# Altium project HalfBridgeDriverModule.PrjPcb
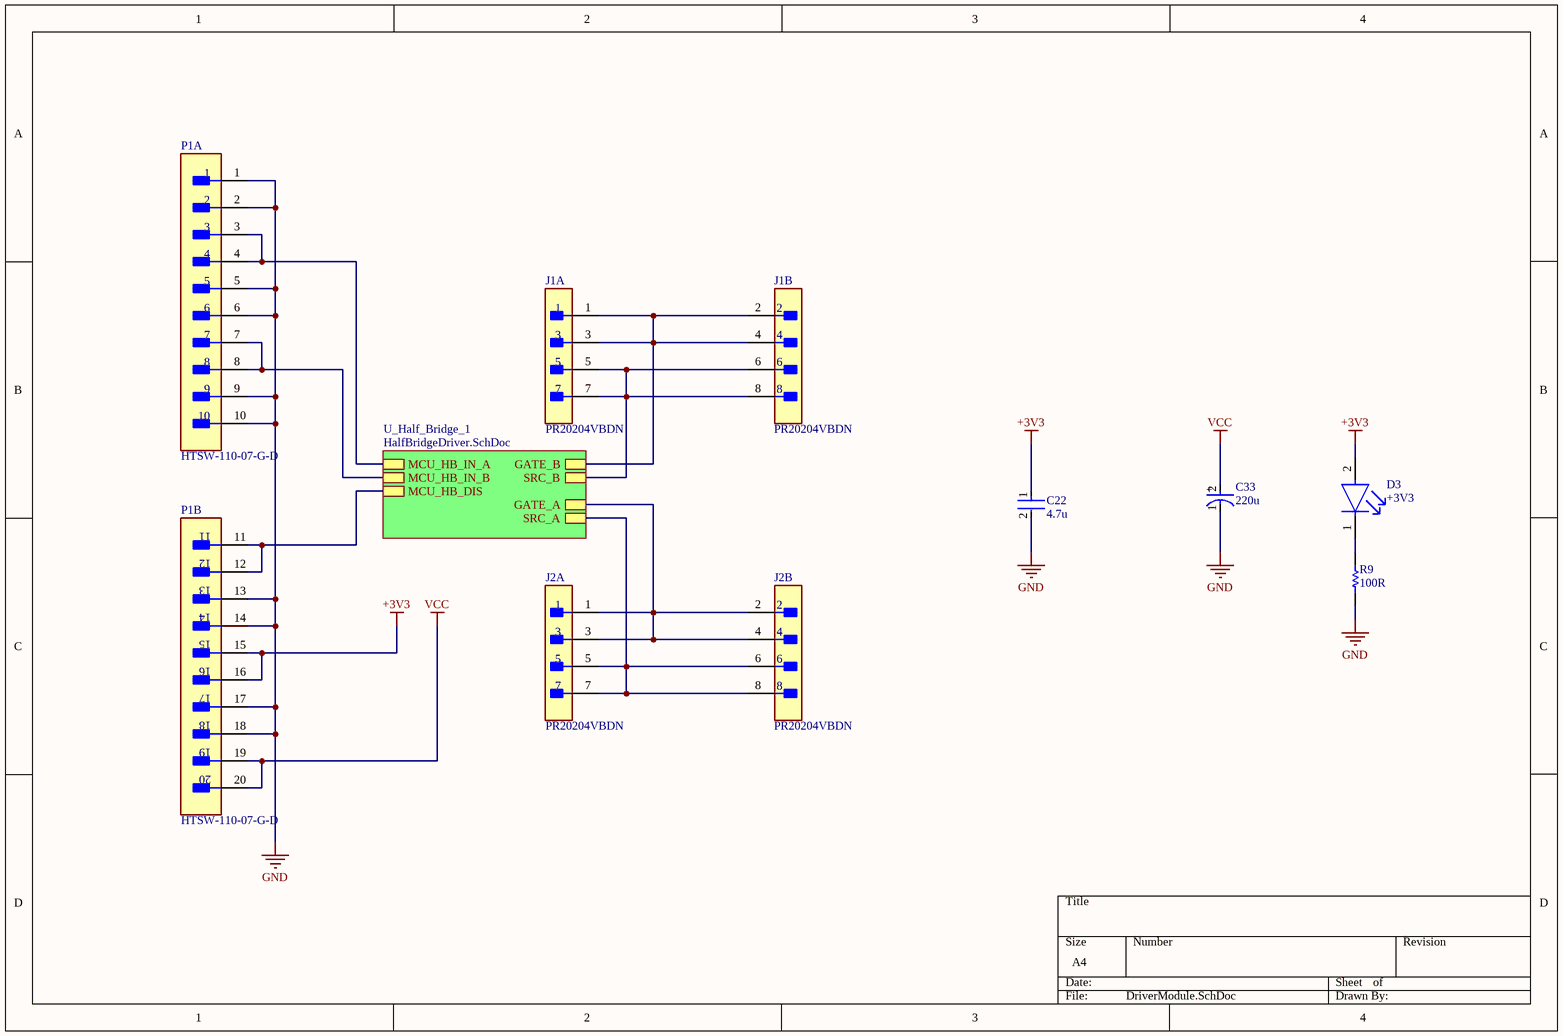
[diagram p0: DriverModule.SchDoc]
2 sheets, 37 parts. Net scope: hierarchical (ports join the sheet entries above them; power ports are global).
Board file: HalfBridgeDriverBoard.PcbDoc
Sheets:
  DriverModule.SchDoc
    U_Half_Bridge_1 = HalfBridgeDriver.SchDoc

## Sheet DriverModule.SchDoc
size A4; SheetNumber: 1; SheetTotal: 2

### Parts
C22  4.7u  [FP-GRM31C-0_2-e0_3_0_8-IPC_C]
C33  220u  [FP-RAD-TH-D_5_0_5-L_7_1-F-MFG]
D3  +3V3  [FP-LTST-C171KGKT-MFG]
J1  PR20204VBDN  [FP-PR20204VBDN-MFG]  (parts A,B of 2)
J2  PR20204VBDN  [FP-PR20204VBDN-MFG]  (parts A,B of 2)
P1  HTSW-110-07-G-D  [FP-HTSW-110-07-G-D-MFG]  (parts A,B of 2)
R9  100R  [RESC2013X60X35ML10T20]

### Sub-sheets
U_Half_Bridge_1 = HalfBridgeDriver.SchDoc: GATE_B, SRC_B, GATE_A, SRC_A, MCU_HB_IN_B, MCU_HB_IN_A, MCU_HB_DIS

### Nets
+3V3: C22.1 D3.2(A) P1.15 P1.16
GND: C22.2 C33.1(C) P1.1 P1.2 P1.5 P1.6 P1.9 P1.10 P1.13 P1.14 P1.17 P1.18 R9.1
VCC: C33.2(A) P1.19 P1.20
NetC12_2: J2.5 J2.6 J2.7 J2.8 ; sheet U_Half_Bridge_1/SRC_A
NetC18_2: J1.5 J1.6 J1.7 J1.8 ; sheet U_Half_Bridge_1/SRC_B
NetD1_1: J2.1 J2.2 J2.3 J2.4 ; sheet U_Half_Bridge_1/GATE_A
NetD2_1: J1.1 J1.2 J1.3 J1.4 ; sheet U_Half_Bridge_1/GATE_B
NetD3_1: D3.1(C) R9.2
NetP1_3: P1.3 P1.4 ; sheet U_Half_Bridge_1/MCU_HB_IN_A
NetP1_7: P1.7 P1.8 ; sheet U_Half_Bridge_1/MCU_HB_IN_B
NetP1_11: P1.11 P1.12 ; sheet U_Half_Bridge_1/MCU_HB_DIS

### Notes on the sheet
- (in symbol CMP-05427-001207-1) +

### Library data of the parts
C22 = CMP-06035-057352-1: Chip Multilayer Ceramic Capacitors for General Purpose, 1206, 4.7uF, X7R, 15%, 20%, 50V; Height: 1.6mm; Capacitance: 4.7uF; Radiation Hardening: No; Min Operating Temperature: -55°C; Tolerance: 20%; Packaging: Tape and Reel; Case Code (Imperial): 1206; Mount: Surface Mount; Termination: SMD/SMT; Case/Package: 1206; Depth: 1.6mm; Width: 0.063inch; Max Operating Temperature: 125°C; Thickness: 0.071inch; Voltage Rating (DC): 50V; Package Quantity: 2000; Voltage Rating: 50V; Lead Free: Lead Free; Length: 3.2mm; Case Code (Metric): 3216; Dielectric: X7R
C33 = CMP-05427-001207-1: Aluminum Electrolytic Capacitors (Radial Lead Type) 22uF ±20% 25V; Ripple Current: 55mA; Life (Hours): 1000Hour; Length: 7mm; Series: KA; RoHS Compliant: Yes; Lead Pitch: 2.5mm; Capacitance: 22uF; Height: 7mm; Packaging: Ammo Pack; Package Quantity: 2000; Radiation Hardening: No; Diameter: 5mm; Min Operating Temperature: -40°C; Termination: Radial; Height - Seated (Max): 0.315inch; Max Operating Temperature: 85°C; Mount: Through Hole; Case/Package: Radial; Tolerance: 20%; Voltage Rating (DC): 25V; Voltage Rating: 25V
D3 = CMP-22017-000037-1: LED GREEN CLEAR SMD; Number of LEDs: 1; Viewing Angle: 130°; Lens Style: Rectangular; Dominant Wavelength: 571nm; Test Current: 20mA; Luminous Intensity: 35mcd; Power Rating: 75mW; Forward Voltage: 2.4V; Forward Current: 30mA; Reverse Voltage: 5V; Lens Color: Colorless; Wavelength: 574nm; Height: 0.8mm; Illumination Color: Green; Length: 2mm; Case/Package: 0805; Number of Pins: 2; Number of Elements: 1; Package Quantity: 1; Depth: 1.25mm; Lens Transparency: Clear; Width: 1.25mm; Color: Green; Radiation Hardening: No; Mount: Surface Mount; Packaging: Tape and Reel; Case Code (Metric): 2012; Lead Free: Lead Free; Max Operating Temperature: 85°C; Min Operating Temperature: -55°C; Case Code (Imperial): 0805; Power Dissipation: 75mW
J1 J2 = CMP-77940-000004-1: PIN HEADER, THR, DUAL ROW, .100"
P1 = CMP-02766-001761-1: CONN HEADER VERT 20POS 2.54MM; Row Spacing: 0.1inch; Number of Contacts: 20; Max Voltage Rating (AC): 550V; Gender: Male; Connector Type: Male Pin; Max Current Rating: 7.6A; Housing Material: Polymer; Series: HTSW; Contact Mating Length: 0.23inch; Number of Rows: 2; Reach SVHC Compliant: Yes; Depth: 5.02mm; Color: Natural; Max Operating Temperature: 125°C; Pitch: 0.1inch; Contact Type: Male Pin; Mount: Through Hole; Number of Positions: 20; Contact Plating: Gold; Length: 25.4mm; RoHS Compliant: Yes; Termination: Solder; Packaging: Bulk; Housing Color: Natural; Package Quantity: 1; Min Operating Temperature: -55°C; Contact Material: Bronze; Orientation: Straight
R9 = CMP-2100-03669-1: Chip Resistor, 100 Ohm, +/-1%, 0.125 W, -55 to 155 degC, 0805 (2012 Metric), RoHS, Tape and Reel; Manufacturer: Yageo; Power Rating: 125mW; Resistance: 100Ohm; Voltage Rating: 150V; Tolerance: 1%; Temperature Coefficient: 100ppm/degreesC; Length: 2mm; Package Description: 2-Pin Surface Mounted Device, Body 2 x 1.25 mm; Case Code (Imperial): 0805; Number of Pins: 2; Termination: SMD/SMT; Lead Pitch: 0.4mm; Package Quantity: 1; Height: 0.024inch; Case Code (Metric): 2012; Number of Terminations: 2; Datasheet Version: Rev. 5, 10/2016; Lead Free: LeadFree; Package Reference: 0805; Composition: ThickFilm; REACH SVHC: Unknown; Voltage Rating (DC): 150V; Min Operating Temperature: -55degC; Packaging: TapeandReel; Military Standard: Not; Case/Package: 0805; Datasheet URL: http://www.yageo.com/NewPortal/yageodocoutput?fileName=/pdf/R-Chip/PYu-RC_Group_51_RoHS_L_5.pdf; Max Operating Temperature: 155degC; Manufacturer URL: http://www.yageo.com/; Max Power Dissipation: 125mW; Width: 0.049inch; Depth: 1.25mm; RoHSCompliant: true

## Sheet HalfBridgeDriver.SchDoc
size A4; SheetNumber: 2; SheetTotal: 2
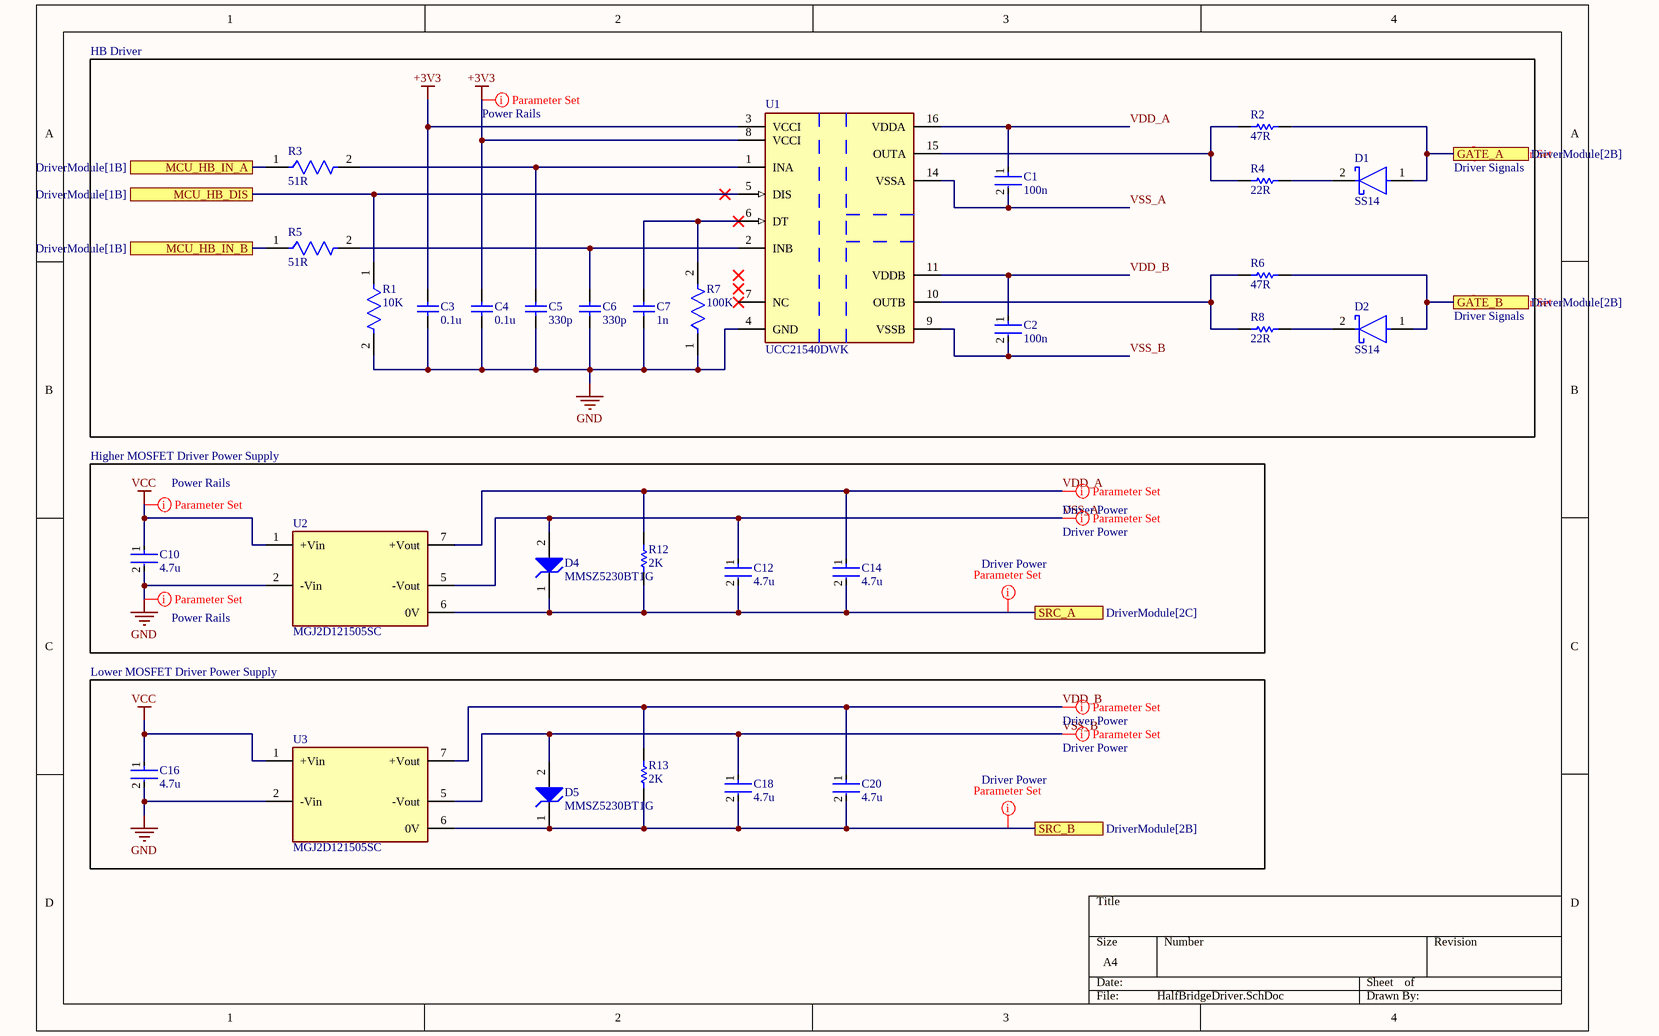
[diagram p1: HalfBridgeDriver.SchDoc]

### Parts
C1  100n  [FP-C1206C-EB-MFG]
C2  100n  [FP-C1206C-EB-MFG]
C3  0.1u  [CAPC2013X145X48NL20T23]
C4  0.1u  [CAPC2013X145X48NL20T23]
C5  330p  [CAPC0805(2012)75_M]
C6  330p  [CAPC0805(2012)75_M]
C7  1n  [CAPC2013X145X48ML20T23]
C10  4.7u  [FP-GRM31C-0_2-e0_3_0_8-IPC_C]
C12  4.7u  [FP-GRM31C-0_2-e0_3_0_8-IPC_C]
C14  4.7u  [FP-GRM31C-0_2-e0_3_0_8-IPC_C]
C16  4.7u  [FP-GRM31C-0_2-e0_3_0_8-IPC_C]
C18  4.7u  [FP-GRM31C-0_2-e0_3_0_8-IPC_C]
C20  4.7u  [FP-GRM31C-0_2-e0_3_0_8-IPC_C]
D1  SS14  [FP-403AE-MFG]
D2  SS14  [FP-403AE-MFG]
D4  MMSZ5230BT1G  [ONSC-SOD-123-2-425-04_V]
D5  MMSZ5230BT1G  [ONSC-SOD-123-2-425-04_V]
R1  10K  [FP-SR0805-MFG]
R2  47R  [RESC3116X65X40NL10T20]
R3  51R  [FP-RT0805-MFG]
R4  22R  [RESC3116X65X40LL10T20]
R5  51R  [FP-RT0805-MFG]
R6  47R  [RESC3116X65X40NL10T20]
R7  100K  [FP-RT0805-MFG]
R8  22R  [RESC3116X65X40LL10T20]
R12  2K  [RESC3116X65X40LL10T20]
R13  2K  [RESC3116X65X40LL10T20]
U1  UCC21540DWK  [FP-DW0016B-MFG]
U2  MGJ2D121505SC  [FP-MGJ2D121505SC-MFG]
U3  MGJ2D121505SC  [FP-MGJ2D121505SC-MFG]

### Blocks framed on the sheet
HB Driver: C1-C7 D1 D2 R1-R8 U1
Higher MOSFET Driver Power Supply: C10 C12 C14 D4 R12 U2
Lower MOSFET Driver Power Supply: C16 C18 C20 D5 R13 U3

### Ports
GATE_A (see DriverModule[2B]), GATE_B (see DriverModule[2B]), MCU_HB_DIS (see DriverModule[1B]), MCU_HB_IN_A (see DriverModule[1B]), MCU_HB_IN_B (see DriverModule[1B]), SRC_A (see DriverModule[2C]), SRC_B (see DriverModule[2B])

### Nets
+3V3: C3.2 C4.2 U1.3(VCCI) U1.8(VCCI)
GND: C3.1 C4.1 C5.1 C6.1 C7.1 C10.2 C16.2 R1.2 R7.1 U1.4(GND) U2.2(-Vin) U3.2(-Vin)
VCC: C10.1 C16.1 U2.1(+Vin) U3.1(+Vin)
VDD_A: C1.1 C14.1 R12.2 U1.16(VDDA) U2.7(+Vout)
VDD_B: C2.1 C20.1 R13.2 U1.11(VDDB) U3.7(+Vout)
VSS_A: C1.2 C12.1 D4.2(A) U1.14(VSSA) U2.5(-Vout)
VSS_B: C2.2 C18.1 D5.2(A) U1.9(VSSB) U3.5(-Vout)
NetC5_2: C5.2 R3.2 U1.1(INA)
NetC6_2: C6.2 R5.2 U1.2(INB)
NetC7_2: C7.2 R7.2 U1.6(DT)
NetC12_2: C12.2 C14.2 D4.1(K) R12.1 U2.6(0V) ; port SRC_A
NetC18_2: C18.2 C20.2 D5.1(K) R13.1 U3.6(0V) ; port SRC_B
NetD1_1: D1.1(A) R2.2 ; port GATE_A
NetD1_2: D1.2(C) R4.2
NetD2_1: D2.1(A) R6.2 ; port GATE_B
NetD2_2: D2.2(C) R8.2
NetP1_3: R3.1 ; port MCU_HB_IN_A
NetP1_7: R5.1 ; port MCU_HB_IN_B
NetP1_11: R1.1 U1.5(DIS) ; port MCU_HB_DIS
NetR2_1: R2.1 R4.1 U1.15(OUTA)
NetR6_1: R6.1 R8.1 U1.10(OUTB)

Not connected (* = marked no-connect by the designer): U1 7(NC)*

### Layout directives
net class Driver Power: NetC12_2, NetC18_2, VDD_A, VDD_B, VSS_A, VSS_B
net class Driver Signals: NetD1_1, NetD2_1
net class Power Rails: +3V3, GND, VCC

### Library data of the parts
C1 C2 = CMP-03020-006572-2: C1206 0.10 μF X7R 20.00% 50 V; Manufacturer Part Number: C1206C104M5RACAUTO; Manufacturer: KEMET; Material: Ceramic; Automotive Grade: Grade 0; Voltage Rating: 50 V; Value: 0.10 μF; Tolerance: 0.2; Temperature Coefficient: 15%; Temperature Range Low: -55°C; Device Class L3: Ceramic Capacitors; Capacitance: 0.10 μF; Octopart: https://octopart.com/c1206c104m5racauto-kemet-82343739; Device Class L1: Passive Components; RoHS: TRUE; ComponentLink2URL: https://content.kemet.com/datasheets/KEM_C1007_X8R_ULTRA_150C_SMD.pdf; Device Class L2: Capacitors; Package: C1206C-EB; Automotive: Yes; Temperature Characteristic: X7R; Category: Cap; ComponentLink2Description: Datasheet; Lead Free: Yes; Height: 0.88mm; Ipc Land Pattern Name: CAPC320160X78; Temperature: -55°C to +150°C; Temperature Range High: +150°C
C3 C4 = CMP-2007-01705-1: Part Number: VJ0805Y104KXAMR; Manufacturer: Vitramon
C5 C6 = CMP-1036-01439-1: CAP 33pF 100V ±2% 0805 (2012 Metric) Thickness 0.75mm SMD; Case-Metric: 2012; Tolerance: Â±2%; Case-EIA: 0805; Max Thickness: 0.75 mm; Value: 33pF; Rated Voltage: 100 V; Technology: SMT
C7 = CMP-2007-03154-1: Part Number: VJ0805Y102KXAMC; Manufacturer: Vitramon
C10 C12 C14 C16 C18 C20 = CMP-06035-057352-1: as C22 on sheet DriverModule; Height: 1.6mm; Capacitance: 4.7uF; Radiation Hardening: No; Min Operating Temperature: -55°C; Tolerance: 20%; Packaging: Tape and Reel; Case Code (Imperial): 1206; Mount: Surface Mount; Termination: SMD/SMT; Case/Package: 1206; Depth: 1.6mm; Width: 0.063inch; Max Operating Temperature: 125°C; Thickness: 0.071inch; Voltage Rating (DC): 50V; Package Quantity: 2000; Voltage Rating: 50V; Lead Free: Lead Free; Length: 3.2mm; Case Code (Metric): 3216; Dielectric: X7R
D1 D2 = CMP-2000-04943-2: DIODE SCHOTTKY 40V 1A SMA; Manufacturer: ON Semiconductor; Peak Reverse Current: 0.2mA; Max Junction Temp: +125°C; Standoff Height: 0.05mm; Max Surge Forward Current: 40A; Mouser Description: Schottky Diodes & Rectifiers SMA 40V 1.0A; RoHS: TRUE; Lead Free: Yes; Manufacturer Part Number: SS14; Device Class L3: Schottky Diodes; Category: Diode; Automotive: No; Digikey Description: DIODE SCHOTTKY 40V 1A SMA; ComponentLink2Description: Datasheet; Device Class L2: Diodes; Height: 2.5mm; Temperature Range High: +125°C; ComponentLink2URL: https://www.onsemi.com/pub/Collateral/SS19-D.PDF; Device Class L1: Discrete Semiconductors; Package: 403AE; Octopart: https://octopart.com/ss14-on+semiconductor-29205033; Max Repetitive Reverse Voltage: 40V; Temperature Range Low: -65°C; Forward Current: 1A; Temperature: -65°C to +125°C
D4 D5 = CMP-1060-00571-1: Zener Voltage Regulator, 500 mW, 2-Pin SOD-123, Pb-Free, Tape and Reel; Manufacturer: On Semiconductor; VZ Typ (V): 4.7; P Max (W): 0.5; RoHS: Pb-Free; ComponentLink2URL: http://www.onsemi.com/pub_link/Collateral/MMSZ5221BT1-D.PDF; ComponentLink3URL: http://www.onsemi.com/pub_link/Collateral/425-04.PDF; PackageDescription: 2-Pin SOD, Body 1.6 x 2.69 mm; DatasheetVersion: Rev. 12; Packing: Tape and Reel; Mounting Technology: Surface Mount; ComponentLink2Description: Datasheet; ComponentLink1Description: Manufacturer URL; PackageReference: SOD-123-2-425-04; ComponentLink1URL: http://www.onsemi.com/; PackageVersion: Rev. G, 10/2009; ComponentLink3Description: Package Specification; PartNumber: MMSZ5230BT1G
R1 = CMP-03412-008440-1: RES SMD 10K OHM 1% 1/8W 0805; Manufacturer Part Number: SR0805FR-0710KL; Manufacturer: Yageo; Value: 10KΩ; Automotive Grade: Grade 0; Power Rating: 0.125W; Tolerance: 0.01; Voltage Rating: 150V; Temperature: -55°C to +155°C; Height: 0.6mm; Automotive: Yes; Digikey Description: RES SMD 10K OHM 1% 1/8W 0805; Resistance: 10KΩ; Package: SR0805; Footprint Url: http://www.yageo.com/exep/pages/download/literatures/PYu-R_Mount_10.pdf; Temperature Range Low: -55°C; Device Class L2: Resistors; Category: Res; ComponentLink2Description: Datasheet; Temperature Range High: +155°C; ComponentLink2URL: http://www.yageo.com/documents/recent/PYu-SR_D_F%20tol_RoHS_L_3.pdf; Ipc Land Pattern Name: RESC200125X50; Device Class L1: Passive Components; Octopart: https://octopart.com/sr0805fr-0710kl-yageo-71414332; Lead Free: Yes; Series: SR; Composition: Thick Film; RoHS: TRUE; Device Class L3: Chip SMD Resistors
R2 R6 = CMP-2003-04943-1: Part Number: RC1206FR-1047RL; Manufacturer: Yageo
R3 R5 = CMP-03412-015517-1: RES SMD 51 OHM 1% 1/8W 0805; Manufacturer: Yageo; Manufacturer Part Number: RT0805FRD0751RL; Temperature Coefficient: 25 ppm/°C; Power Rating: 0.125W; Value: 51Ω; Voltage Rating: 150V; Tolerance: 0.0001; Category: Res; Package: RT0805; Lead Free: Yes; Device Class L1: Passive Components; Footprint Url: http://www.yageo.com/exep/pages/download/literatures/PYu-R_Mount_10.pdf; RoHS: TRUE; Series: RT; ComponentLink2URL: http://www.yageo.com/documents/recent/PYu-RT_1-to-0.01_RoHS_L_9.pdf; Composition: Thin Film; Temperature Range High: +155°C; Temperature: -55°C to +155°C; Resistance: 51Ω; Ipc Land Pattern Name: RESC200125X50; ComponentLink2Description: Datasheet; Digikey Description: RES SMD 51 OHM 1% 1/8W 0805; Octopart: https://octopart.com/rt0805frd0751rl-yageo-71400104; Temperature Range Low: -55°C; Device Class L2: Resistors; Height: 0.6mm; Device Class L3: Chip SMD Resistors; Automotive: No
R4 R8 = CMP-2003-04942-1: Part Number: RC1206FR-1022RL; Manufacturer: Yageo
R7 = CMP-03412-003710-1: RES SMD 100K OHM 0.1% 1/8W 0805; Manufacturer Part Number: RT0805BRC07100KL; Manufacturer: Yageo; Value: 100KΩ; Power Rating: 0.125W; Temperature Coefficient: 15 ppm/°C; Voltage Rating: 150V; Tolerance: 0.0025; Lead Free: Yes; ComponentLink2Description: Datasheet; Footprint Url: http://www.yageo.com/exep/pages/download/literatures/PYu-R_Mount_10.pdf; Package: RT0805; Device Class L1: Passive Components; Octopart: https://octopart.com/rt0805brc07100kl-yageo-20648691; Height: 0.6mm; Digikey Description: RES SMD 100K OHM 0.1% 1/8W 0805; Series: RT; RoHS: TRUE; Category: Res; Ipc Land Pattern Name: RESC200125X50; ComponentLink2URL: http://www.yageo.com/documents/recent/PYu-RT_1-to-0.01_RoHS_L_9.pdf; Device Class L3: Chip SMD Resistors; Device Class L2: Resistors; Temperature Range Low: -55°C; Resistance: 100KΩ; Automotive: No; Composition: Thin Film; Temperature Range High: +155°C; Temperature: -55°C to +155°C
R12 R13 = CMP-2003-04030-1: Part Number: RC1206JR-132KL; Manufacturer: Yageo
U1 = CMP-04912-000086-1: DGTL ISO 5.7KV GATE DRVR 16SOIC; Pulse Width Distortion (PWD): 5ns; Propagation Delay: 30ns; High Level Output Current: 6A; Number of Channels: 2; Low Level Output Current: 4A; Approvals: CSA; Working Voltage: 2.121kV; Case/Package: SOIC; Mount: Surface Mount; Packaging: Tape and Reel; Number of Pins: 16; Max Operating Temperature: 125°C; Min Operating Temperature: -40°C; RoHS Compliant: Yes
U2 U3 = CMP-20596-000010-1: DC DC CONVERTER 15V -5V 2W; Efficiency: 80%; Isolation Voltage: 5.2kV; Max Input Voltage (DC): 13.2V; Nominal Input Voltage: 12V; Current - Output 1: 80mA; Number of Outputs: 2; Max Power Dissipation: 1W; Min Input Voltage (DC): 10.8V; Max Output Current: 40mA; Max Operating Temperature: 100°C; Features: SCP; Length: 0.77inch; Max Input Voltage: 13.2V; Radiation Hardening: No; Width: 0.39inch; Output Voltage: 15V; Packaging: Rail/Tube; Voltage - Output 2: -5V; RoHS Compliant: Yes; REACH SVHC: No SVHC; Min Operating Temperature: -40°C; Package Quantity: 25; Weight: 0.151678oz; Case/Package: SIP; Min Input Voltage: 10.8V; Voltage - Output 1: 15V; Output Power: 2W; Number of Pins: 5; Depth: 19.65mm; Height: 0.5inch; Current - Output 2: 40mA; Output Current: 80mA; Mount: Through Hole; Max Output Power: 2W

## Nets that join several sheets
+3V3: DriverModule (C22.1 D3.2 P1.15 P1.16), HalfBridgeDriver (C3.2 C4.2 U1.3 U1.8)
GND: DriverModule (13 pins), HalfBridgeDriver (12 pins)
VCC: DriverModule (C33.2 P1.19 P1.20), HalfBridgeDriver (C10.1 C16.1 U2.1 U3.1)
NetC12_2: DriverModule (J2.5 J2.6 J2.7 J2.8), HalfBridgeDriver (5 pins)
NetC18_2: DriverModule (J1.5 J1.6 J1.7 J1.8), HalfBridgeDriver (5 pins)
NetD1_1: DriverModule (J2.1 J2.2 J2.3 J2.4), HalfBridgeDriver (D1.1 R2.2)
NetD2_1: DriverModule (J1.1 J1.2 J1.3 J1.4), HalfBridgeDriver (D2.1 R6.2)
NetP1_3: DriverModule (P1.3 P1.4), HalfBridgeDriver (R3.1)
NetP1_7: DriverModule (P1.7 P1.8), HalfBridgeDriver (R5.1)
NetP1_11: DriverModule (P1.11 P1.12), HalfBridgeDriver (R1.1 U1.5)